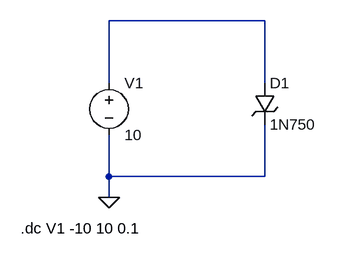
[diagram p0: schematic zener_diode.asc]
zener_diode.asc, the LTspice schematic file:
Version 4
SHEET 1 880 680
WIRE 304 16 64 16
WIRE 64 112 64 16
WIRE 304 112 304 16
WIRE 64 256 64 192
WIRE 304 256 304 176
WIRE 304 256 64 256
WIRE 64 288 64 256
FLAG 64 288 0
SYMBOL voltage 64 96 R0
WINDOW 123 0 0 Left 2
WINDOW 39 0 0 Left 2
SYMATTR InstName V1
SYMATTR Value 10
SYMBOL zener 288 112 R0
SYMATTR InstName D1
SYMATTR Value 1N750
SYMATTR Description Diode
SYMATTR Type diode
TEXT -72 336 Left 2 !.dc V1 -10 10 0.1

The netlist it stands for:
* zener_diode.asc
V1 N001 0 10
D1 N001 0 1N750
.model D D
.lib standard.dio
.dc V1 -10 10 0.1
.backanno
.end